# Altium project BV10011_UniversalSlave.PrjPcb
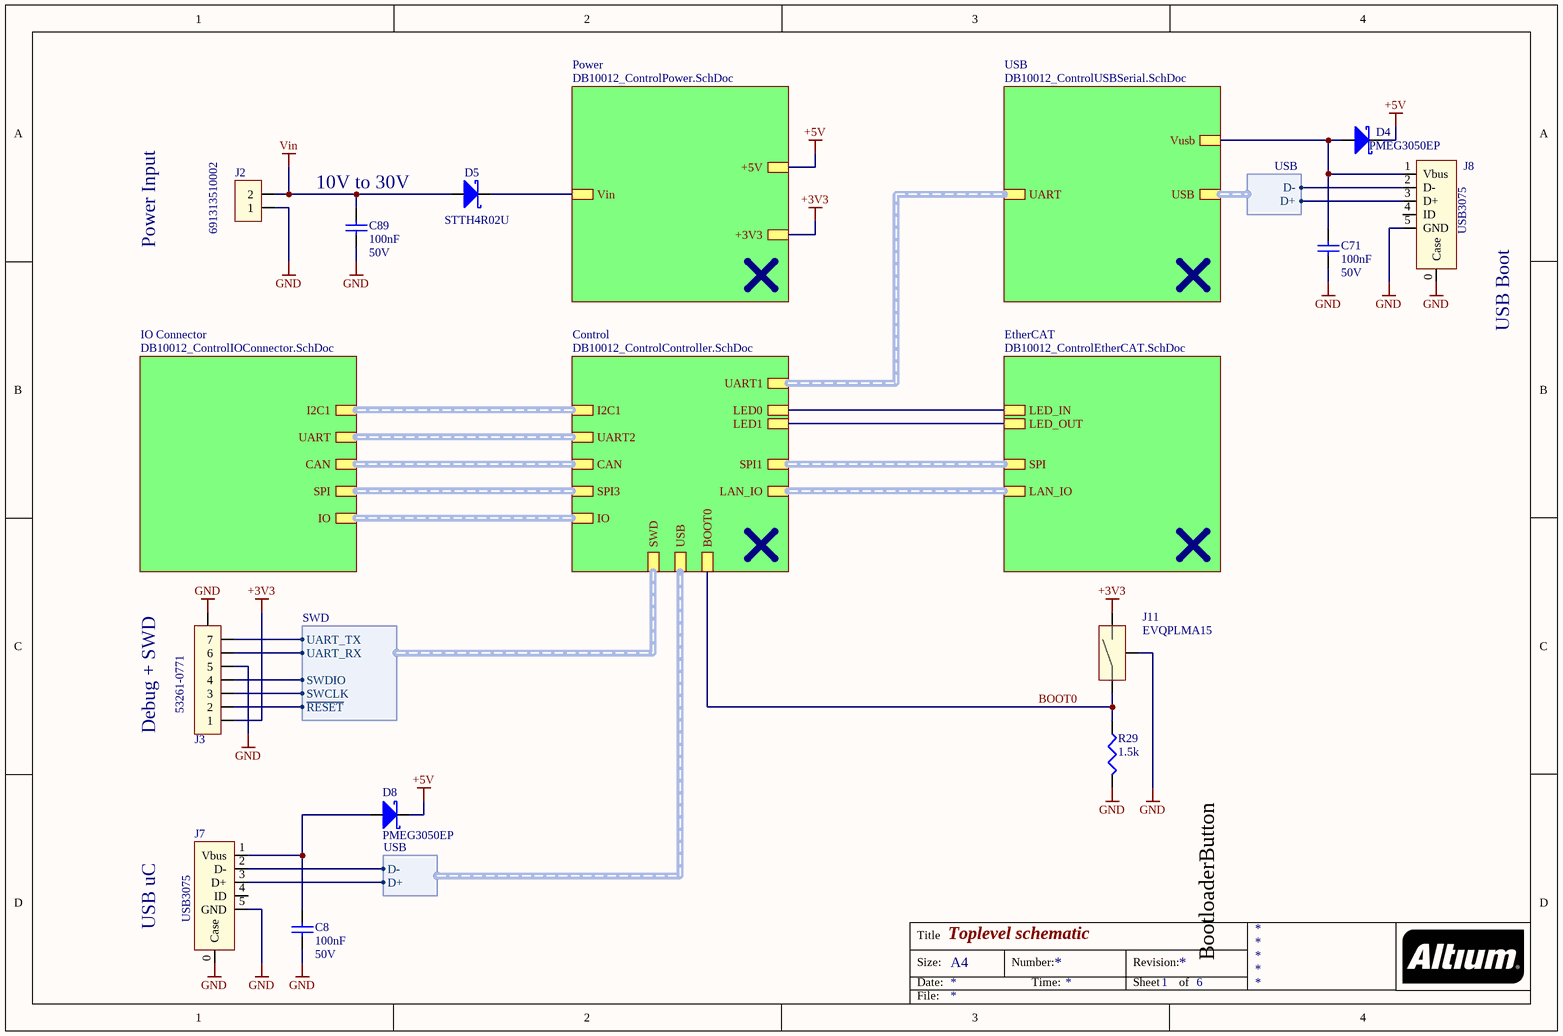
[diagram p0: BV10011_ControlTopLevel.SchDoc]
6 sheets, 118 parts. Net scope: hierarchical (ports join the sheet entries above them; power ports are global).
Board file: BV10011_UniversalSlave.PcbDoc
Sheets:
  BV10011_ControlTopLevel.SchDoc
  BV10011_ControlPower.SchDoc
  BV10011_ControlUSBSerial.SchDoc
  BV10011_ControlEtherCAT.SchDoc
  BV10011_ControlController.SchDoc
  BV10011_ControlIOConnector.SchDoc

## Sheet BV10011_ControlTopLevel.SchDoc: Toplevel schematic
size A4; SheetNumber: 1; SheetTotal: 6

### Parts
C8  100nF  Voltage Rating: 50V  [C-0805]
C71  100nF  Voltage Rating: 50V  [C-0805]
C89  100nF  Voltage Rating: 50V  [C-0805]
D4  PMEG3050EP  [SOD128]
D5  STTH4R02U  [CASE 403A-03]
D8  PMEG3050EP  [SOD128]
J2  691313510002  [691313510002]
J3  53261-0771  [53261-0771]
J7  USB3075  [USB3075 - NOSLOT]
J8  USB3075  [USB3075 - NOSLOT]
J11  EVQPLMA15  [EVQPLM]
R29  1.5k  [0402]

### Sub-sheets
Control = DB10012_ControlController.SchDoc (file not in this document): SPI1 (harness SPI), LAN_IO (harness LAN_IO), UART1 (harness UART), SPI3 (harness SPI), I2C1 (harness I2C1), CAN (harness CAN), UART2 (harness UART), IO (harness IO), USB (harness USB), SWD (harness SWD), BOOT0, LED0, LED1
EtherCAT = DB10012_ControlEtherCAT.SchDoc (file not in this document): SPI (harness SPI), LAN_IO (harness LAN_IO), LED_IN, LED_OUT
IO Connector = DB10012_ControlIOConnector.SchDoc (file not in this document): SPI (harness SPI), I2C1 (harness I2C1), CAN (harness CAN), IO (harness IO), UART (harness UART)
Power = DB10012_ControlPower.SchDoc (file not in this document): +5V, +3V3, Vin
USB = DB10012_ControlUSBSerial.SchDoc (file not in this document): UART (harness UART), USB (harness USB), Vusb

### Harnesses
SWD: UART_TX, UART_RX, SWDIO, SWCLK, ~{RESET}
USB: D-, D+

### Nets
+3V3: J3.1 J11.2 ; sheet Power/+3V3
+5V: D4.2(K) D8.2(K) ; sheet Power/+5V
GND: C8.1 C71.1 C89.1 J2.1 J3.0(SHLD) J3.5 J7.0(Case) J7.5(GND) J8.0(Case) J8.5(GND) J11.0(GND) R29.1
Vin: C89.2 D5.1(A) J2.2
BOOT0: J11.1 R29.2 ; sheet Control/BOOT0
NetC8_2: C8.2 D8.1(A) J7.1(Vbus)
NetC71_2: C71.2 D4.1(A) J8.1(Vbus) ; sheet USB/Vusb
NetD5_2: D5.2(K) ; sheet Power/Vin
NetJ3_2: J3.2 ; sheet Control/SWD.~{RESET}
NetJ3_3: J3.3 ; sheet Control/SWD.SWCLK
NetJ3_4: J3.4 ; sheet Control/SWD.SWDIO
NetJ3_6: J3.6 ; sheet Control/SWD.UART_RX
NetJ3_7: J3.7 ; sheet Control/SWD.UART_TX
NetJ7_2: J7.2(D-) ; sheet Control/USB.D-
NetJ7_3: J7.3(D+) ; sheet Control/USB.D+
NetJ8_2: J8.2(D-) ; sheet USB/USB.D-
NetJ8_3: J8.3(D+) ; sheet USB/USB.D+
(unnamed): sheet EtherCAT/LED_IN, sheet Control/LED0
(unnamed): sheet EtherCAT/LED_OUT, sheet Control/LED1

Not connected (* = marked no-connect by the designer): J7 4(ID); J8 4(ID)

### Buses and harness runs
harness sheet Control/CAN = sheet IO Connector/CAN
harness sheet Control/I2C1 = sheet IO Connector/I2C1
harness sheet Control/IO = sheet IO Connector/IO
harness sheet Control/LAN_IO = sheet EtherCAT/LAN_IO
harness sheet Control/SPI1 = sheet EtherCAT/SPI
harness sheet Control/SPI3 = sheet IO Connector/SPI
harness sheet Control/UART1 = sheet USB/UART
harness sheet Control/UART2 = sheet IO Connector/UART

### Notes on the sheet
- Power Input
- (near C89) 10V to 30V
- USB Boot
- (near J3) Debug + SWD
- BootloaderButton
- USB uC
- Title
- Size:
- Date:
- A4
- Number:
- Time:
- Revision:
- Sheet
- of
- File:

### Library data of the parts
C8 C71 C89 = 100nF/0805/CER/50V: Capacitor, 100nF, 50V,  X7R; Capacitance Tolerance: ± 10%; Capacitor Case Style: 0805; Brand Number: C0805C104K5RACTU; Brand: KEMET; Dielectric Characteristic: X7R; Capacitance: 100nF; Temperature Range: -55°C to +125°C; Price: 0,022; Order Code Supplier: 1414664; Supplier: Farnell
D4 D8 = PMEG3050EP: Diode Schottky, Vrrm: 30V, If: 3A, Vf: 0.36V; Brand: NXP; Case Style: SOD-128; Forward Current: 5A; Brand Number: PMEG3050EP; Forward Voltage: 0.36V; Order Code Supplier: 1829197; Price: 0,25; Supplier: Farnell; Temperature Range: -55°C to +150°C; Vrrm: 30V
D5 = STTH4R02U: Diode Schottky, Vrrm: 200V, If: 4A, Vf: 1,05V; Brand: STMICROELECTRONICS; Case Style: SMB; Forward Current: 3A; Forward Voltage: 1,05V; Brand Number: STTH4R02U; Order Code Supplier: 1295277; Price: 1,09; Supplier: Farnell; Temperature Range: -65°C to +150°C; Vrrm: 200V
J2 = 691313510002: WR-TBL 313 Series, 2 Contacts, Header, 5.08 mm; Brand: Wurth; Pitch: 5.08mm; Brand Number: 691313510002; Case Style: WR-TBL 313 Series; Order Code Supplier: 1641993; Price: 0,343; Supplier: Farnell
J3 = 53261-0771: PicoBlade 53261 Series, 7Pin, Right Angle; Brand: Molex; Pitch: 1,25mm; Brand Number: 53261-0771; Case Style: 53261-0771; Order Code Supplier: 1125361; Price: 1,80; Supplier: Farnell
J7 J8 = USB3075: USB 2.0 MICRO B, RCPT, 5POS, SMT; Brand: Global Connector Technology; Brand Number: USB3075-30-A; Case Style: Micro B SMT; Pitch: 0.8mm; Order Code Supplier: 2443116; Price: 0,313; Supplier: Farnell
J11 = EVQPLMA15: SWITCH, TACT, 4.9MM, SMD, 2.6N; Brand: PANASONIC ELECTRONIC COMPONENTS; Brand Number: EVQPLMA15; Price: 0,169; Order Code Supplier: 2079484; Supplier: Farnell
R29 = 1.5k/0402/0063W/50V: Resistor, 1.5k, 0.1%, 0.0625W, 50V, 100PPM, 0402; Brand: VISHAY DRALORIC; Brand Number: CRCW04021K50FKED; Power Rating: 0.063W; Case Style: 0402; Order Code Supplier: 2121624; Price: 0,0054; Resistance: 1.5k; Supplier: Farnell; Temperature Coefficient: ± 100PPM; Temperature Range: -55°C to +125°C; Voltage Rating: 50V

## Sheet BV10011_ControlPower.SchDoc: Power supply
size A4; SheetNumber: 2; SheetTotal: 6
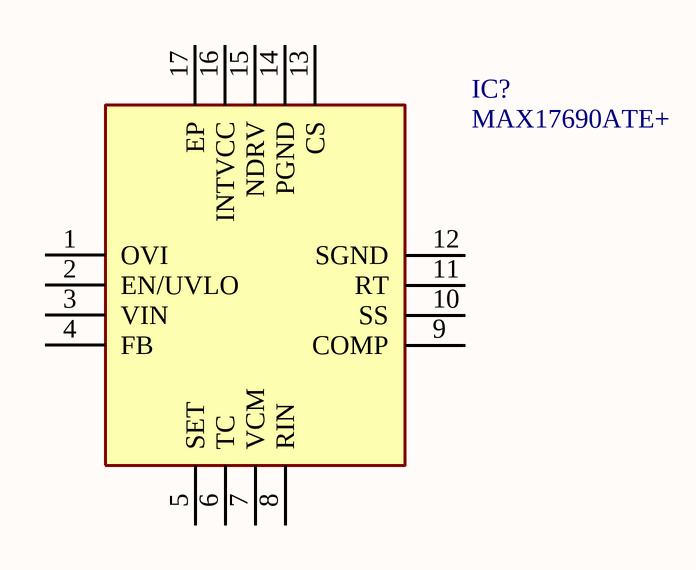
[diagram p1: BV10011_ControlPower.SchDoc]

### Parts
IC?  MAX17690ATE+  [QFN50P300X300X80-17N]

### Nets

Not connected (* = marked no-connect by the designer): IC? 1(OVI) 2(EN/UVLO) 3(VIN) 4(FB) 5(SET) 6(TC) 7(VCM) 8(RIN) 9(COMP) 10(SS) 11(RT) 12(SGND) 13(CS) 14(PGND) 15(NDRV) 16(INTVCC) 17(EP)

### Notes on the sheet
- Title
- Size:
- Date:
- A4
- Number:
- Time:
- Revision:
- Sheet
- of
- File:

### Library data of the parts
IC? = MAX17690ATE+: Integrated Circuit; Manufacturer_Name: Maxim Integrated; Datasheet Link: https://componentsearchengine.com/Datasheets/1/MAX17690ATE+.pdf; Height: 0.8mm; Mouser Part Number: 700-MAX17690ATE+; Mouser Price/Stock: https://www.mouser.com/Search/Refine.aspx?Keyword=700-MAX17690ATE%2B; Manufacturer_Part_Number: MAX17690ATE+

## Sheet BV10011_ControlUSBSerial.SchDoc: USB to serial
size A4; SheetNumber: 3; SheetTotal: 6
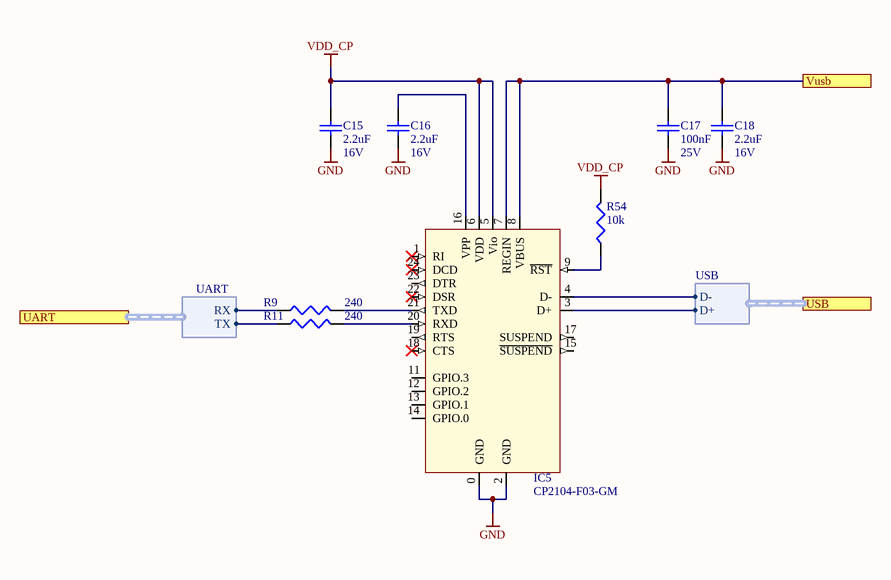
[diagram p2: BV10011_ControlUSBSerial.SchDoc]

### Parts
C15  2.2uF  Voltage Rating: 16V  [C0603]
C16  2.2uF  Voltage Rating: 16V  [C0603]
C17  100nF  Voltage Rating: 25V  [C0402]
C18  2.2uF  Voltage Rating: 16V  [C0603]
IC5  CP2104-F03-GM  [QFN24]
R9  240  [0402]
R11  240  [0402]
R54  10k  [0402]

### Ports
UART (harness UART), USB (harness USB), Vusb

### Harnesses
UART: RX, TX
USB: D-, D+

### Nets
GND: C15.1 C16.1 C17.1 C18.1 IC5.0(GND) IC5.2(GND)
VDD_CP: C15.2 IC5.5(Vio) IC5.6(VDD) R54.2
NetC16_2: C16.2 IC5.16(VPP)
NetC17_2: C17.2 C18.2 IC5.7(REGIN) IC5.8(VBUS) ; port Vusb
NetIC5_3: IC5.3(D+) ; port USB.D+
NetIC5_4: IC5.4(D-) ; port USB.D-
NetIC5_9: IC5.9(~{RST}) R54.1
NetIC5_20: IC5.20(RXD) R11.2
NetIC5_21: IC5.21(TXD) R9.2
NetR9_1: R9.1 ; port UART.RX
NetR11_1: R11.1 ; port UART.TX

Not connected (* = marked no-connect by the designer): IC5 1(RI)* 11(GPIO.3) 12(GPIO.2) 13(GPIO.1) 14(GPIO.0) 15(~{SUSPEND}) 17(SUSPEND) 18(CTS)* 19(RTS) 22(DSR)* 23(DTR) 24(DCD)*

### Notes on the sheet
- Title
- Size:
- Date:
- A4
- Number:
- Time:
- Revision:
- Sheet
- of
- File:

### Library data of the parts
C15 C16 C18 = 2.2uF/0603/CER/16V: Capacitor, 2.2uF, 16V, X5R; Capacitance Tolerance: +/- 10%; Capacitor Case Style: 0603; Brand Number: GRM188R61C225KE15D; Brand: MURATA; Dielectric Characteristic: X5R; Capacitance: 2.2uF; Temperature Range: -55°C to 85°C; Price: 0,077; Order Code Supplier: 1735526; Supplier: Farnell
C17 = 100nF/0402/CER/25V: Capacitor, 100nF, 25V, X7R; Capacitance Tolerance: 10nF; Capacitor Case Style: 0402; Brand Number: GRM155R71E104KE14D; Brand: MULTICOMP; Dielectric Characteristic: X7R; Capacitance: 100nF; Temperature Range: -55 to +125 C; Price: 0,0225; Order Code Supplier: 2456106; Supplier: Farnell
IC5 = CP2104-F03-GM: USB to UART converter; Case Style: QFN24; Price: 1,65; Order Code Supplier: 757-4983; Brand Number: CP2104-F03-GM; Supplier: RS-Components
R9 R11 = 240/0402/0063W/50V: Resistor, 240, 0.1%, 0.0625W, 50V, 100PPM, 0402; Brand: VISHAY DRALORIC; Brand Number: CRCW0402240RFKED; Power Rating: 0.063W; Case Style: 0402; Order Code Supplier: 2121522; Price: 0,0006; Resistance: 240; Supplier: Farnell; Temperature Coefficient: ± 100PPM; Temperature Range: -55°C to +125°C; Voltage Rating: 50V
R54 = 10k/0402/0063W/50V: Resistor, 10k, 0.1%, 0.0625W, 50V, 100PPM, 0402; Brand: VISHAY DRALORIC; Brand Number: CRCW040210K0FKED; Power Rating: 0.063W; Case Style: 0402; Order Code Supplier: 2121730; Price: 0,0005; Resistance: 10k; Supplier: Farnell; Temperature Coefficient: ± 100PPM; Temperature Range: -55°C to +125°C; Voltage Rating: 50V

## Sheet BV10011_ControlEtherCAT.SchDoc: EtherCAT tranceiver
size A2; SheetNumber: 4; SheetTotal: 6
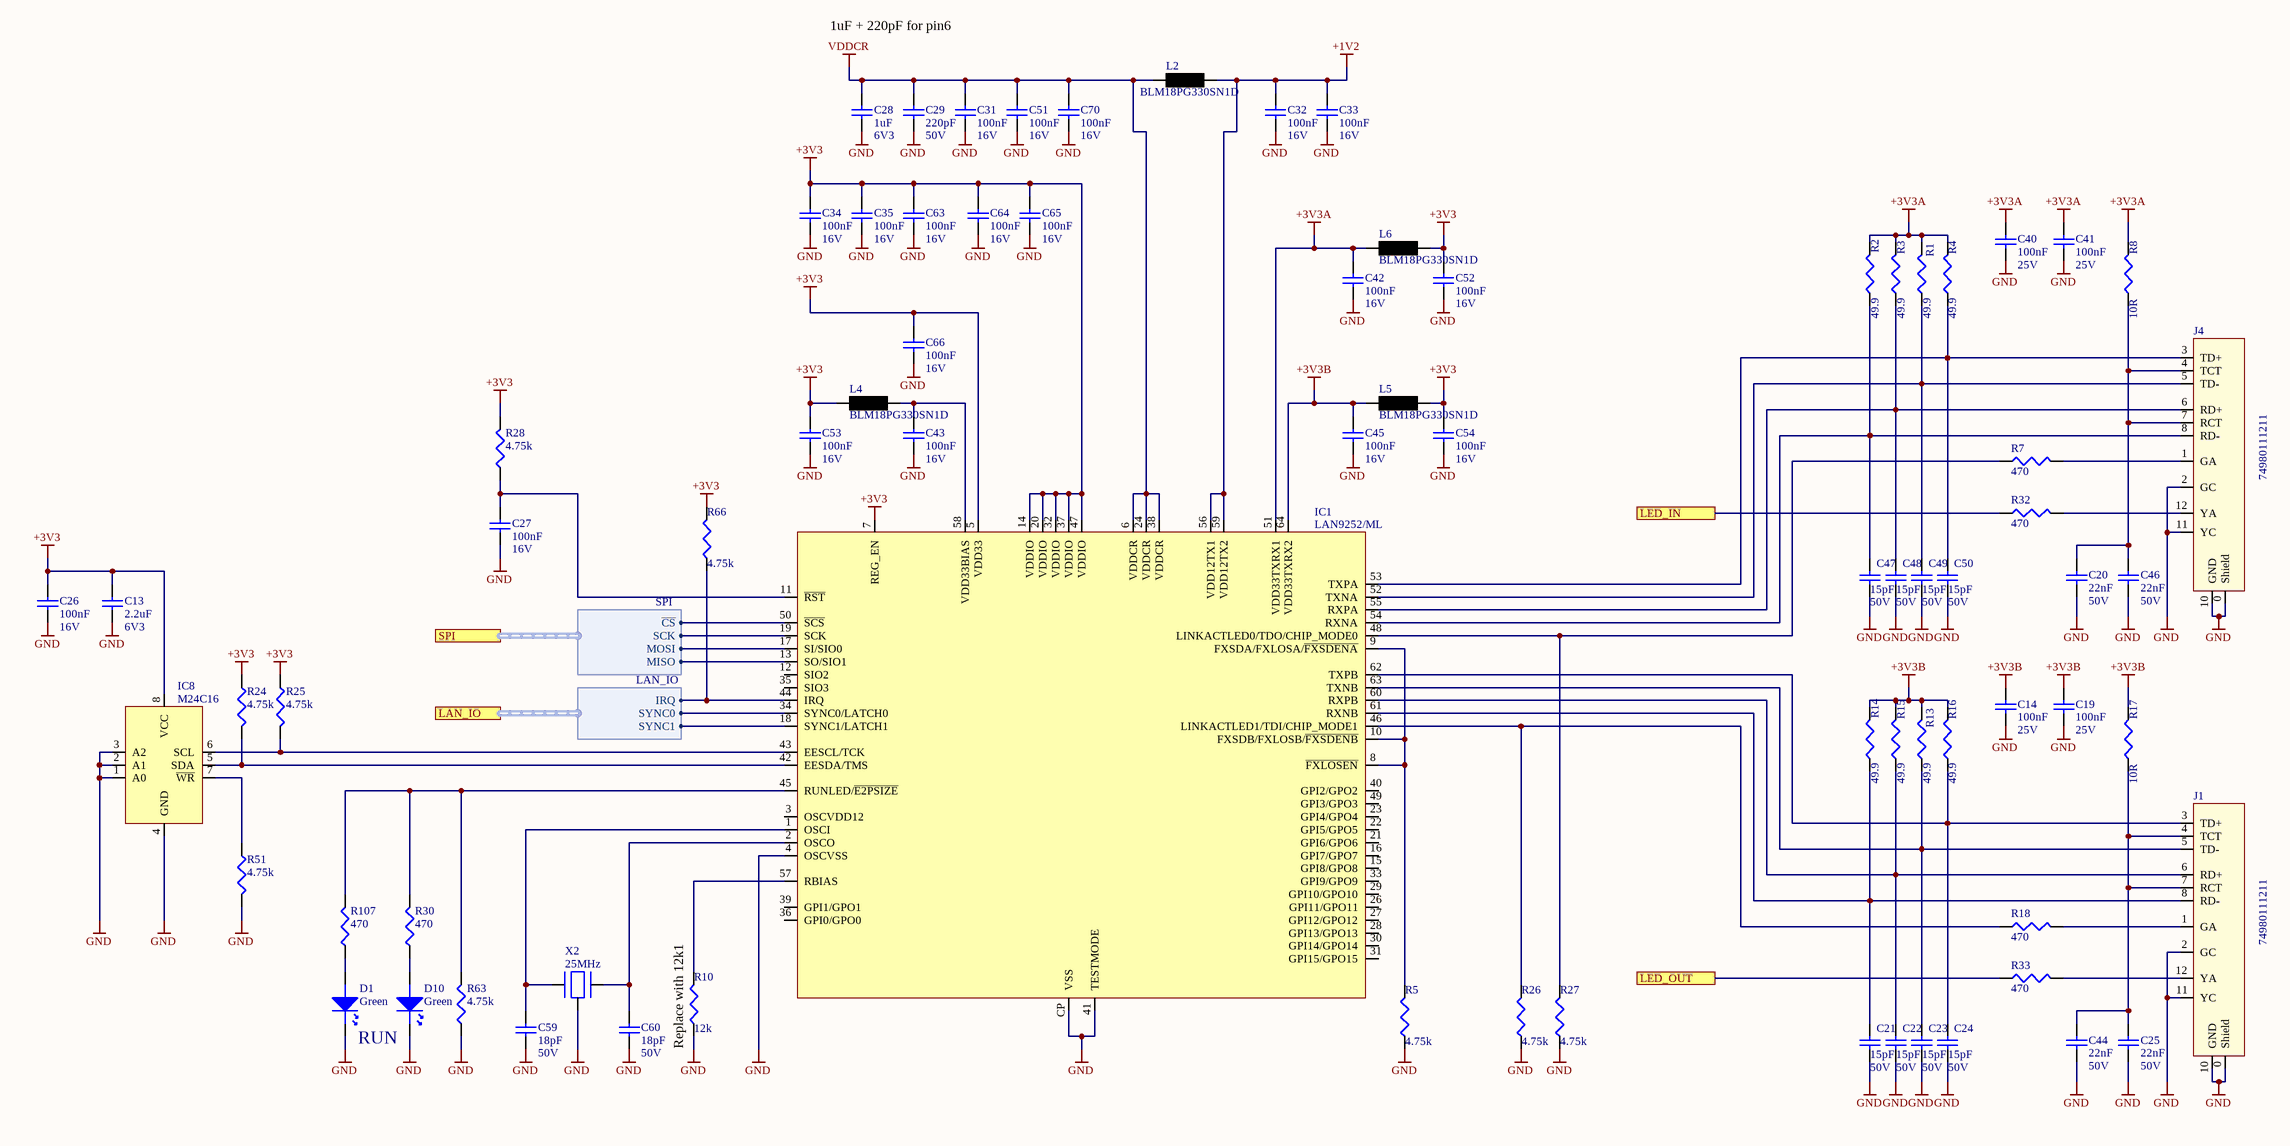
[diagram p3: BV10011_ControlEtherCAT.SchDoc]

### Parts
C13  2.2uF  Voltage Rating: 6V3  [C0402]
C14  100nF  Voltage Rating: 25V  [C0402]
C19  100nF  Voltage Rating: 25V  [C0402]
C20  22nF  Voltage Rating: 50V  [C0402]
C21  15pF  Voltage Rating: 50V  [C0402]
C22  15pF  Voltage Rating: 50V  [C0402]
C23  15pF  Voltage Rating: 50V  [C0402]
C24  15pF  Voltage Rating: 50V  [C0402]
C25  22nF  Voltage Rating: 50V  [C0402]
C26  100nF  Voltage Rating: 16V  [C0402]
C27  100nF  Voltage Rating: 16V  [C0402]
C28  1uF  Voltage Rating: 6V3  [C0402]
C29  220pF  Voltage Rating: 50V  [C0402]
C31  100nF  Voltage Rating: 16V  [C0402]
C32  100nF  Voltage Rating: 16V  [C0402]
C33  100nF  Voltage Rating: 16V  [C0402]
C34  100nF  Voltage Rating: 16V  [C0402]
C35  100nF  Voltage Rating: 16V  [C0402]
C40  100nF  Voltage Rating: 25V  [C0402]
C41  100nF  Voltage Rating: 25V  [C0402]
C42  100nF  Voltage Rating: 16V  [C0402]
C43  100nF  Voltage Rating: 16V  [C0402]
C44  22nF  Voltage Rating: 50V  [C0402]
C45  100nF  Voltage Rating: 16V  [C0402]
C46  22nF  Voltage Rating: 50V  [C0402]
C47  15pF  Voltage Rating: 50V  [C0402]
C48  15pF  Voltage Rating: 50V  [C0402]
C49  15pF  Voltage Rating: 50V  [C0402]
C50  15pF  Voltage Rating: 50V  [C0402]
C51  100nF  Voltage Rating: 16V  [C0402]
C52  100nF  Voltage Rating: 16V  [C0402]
C53  100nF  Voltage Rating: 16V  [C0402]
C54  100nF  Voltage Rating: 16V  [C0402]
C59  18pF  Voltage Rating: 50V  [C0402]
C60  18pF  Voltage Rating: 50V  [C0402]
C63  100nF  Voltage Rating: 16V  [C0402]
C64  100nF  Voltage Rating: 16V  [C0402]
C65  100nF  Voltage Rating: 16V  [C0402]
C66  100nF  Voltage Rating: 16V  [C0402]
C70  100nF  Voltage Rating: 16V  [C0402]
D1  Green  [D-0805]
D10  Green  [D-0805]
IC1  LAN9252/ML  [QFN64_Rect]
IC8  M24C16  [SO-8]
J1  74980111211  [74980111211]
J4  74980111211  [74980111211]
L2  BLM18PG330SN1D  [L0603]
L4  BLM18PG330SN1D  [L0603]
L5  BLM18PG330SN1D  [L0603]
L6  BLM18PG330SN1D  [L0603]
R1  49.9  [0402]
R2  49.9  [0402]
R3  49.9  [0402]
R4  49.9  [0402]
R5  4.75k  [0402]
R7  470  [0402]
R8  10R  [0603]
R10  12k  [0402]
R13  49.9  [0402]
R14  49.9  [0402]
R15  49.9  [0402]
R16  49.9  [0402]
R17  10R  [0603]
R18  470  [0402]
R24  4.75k  [0402]
R25  4.75k  [0402]
R26  4.75k  [0402]
R27  4.75k  [0402]
R28  4.75k  [0402]
R30  470  [0402]
R32  470  [0402]
R33  470  [0402]
R51  4.75k  [0402]
R63  4.75k  [0402]
R66  4.75k  [0402]
R107  470  [0402]
X2  25MHz  [7M]

### Ports
LAN_IO (harness LAN_IO), LED_IN, LED_OUT, SPI (harness SPI)

### Harnesses
SPI: SCK, ~{CS}, MOSI, MISO
LAN_IO: IRQ, SYNC0, SYNC1

### Nets
+1V2: C32.2 C33.2 IC1.56(VDD12TX1) IC1.59(VDD12TX2) L2.2
+3V3: C13.2 C26.2 C34.2 C35.2 C52.2 C53.2 C54.2 C63.2 C64.2 C65.2 C66.2 IC1.5(VDD33) IC1.7(REG_EN) IC1.14(VDDIO) IC1.20(VDDIO) IC1.32(VDDIO) IC1.37(VDDIO) IC1.47(VDDIO) IC8.8(VCC) L4.2 L5.2 L6.2 R24.2 R25.2 R28.2 R66.2
+3V3A: C40.2 C41.2 C42.2 IC1.51(VDD33TXRX1) L6.1 R1.2 R2.2 R3.2 R4.2 R8.2
+3V3B: C14.2 C19.2 C45.2 IC1.64(VDD33TXRX2) L5.1 R13.2 R14.2 R15.2 R16.2 R17.2
GND: C13.1 C14.1 C19.1 C20.1 C21.1 C22.1 C23.1 C24.1 C25.1 C26.1 C27.1 C28.1 C29.1 C31.1 C32.1 C33.1 C34.1 C35.1 C40.1 C41.1 C42.1 C43.1 C44.1 C45.1 C46.1 C47.1 C48.1 C49.1 C50.1 C51.1 C52.1 C53.1 C54.1 C59.1 C60.1 C63.1 C64.1 C65.1 C66.1 C70.1 D1.K D10.K IC1.4(OSCVSS) IC1.41(TESTMODE) IC1.CP(VSS) IC8.1(A0) IC8.2(A1) IC8.3(A2) IC8.4(GND) J1.0(Shield) J1.2(GC) J1.10(GND) J1.11(YC) J4.0(Shield) J4.2(GC) J4.10(GND) J4.11(YC) R5.1 R10.1 R26.1 R27.1 R51.1 R63.1 X2.0
VDDCR: C28.2 C29.2 C31.2 C51.2 C70.2 IC1.6(VDDCR) IC1.24(VDDCR) IC1.38(VDDCR) L2.1
NetC20_2: C20.2 C46.2 J4.4(TCT) J4.7(RCT) R8.1
NetC21_2: C21.2 IC1.61(RXNB) J1.8(RD-) R14.1
NetC22_2: C22.2 IC1.60(RXPB) J1.6(RD+) R15.1
NetC23_2: C23.2 IC1.63(TXNB) J1.5(TD-) R13.1
NetC24_2: C24.2 IC1.62(TXPB) J1.3(TD+) R16.1
NetC25_2: C25.2 C44.2 J1.4(TCT) J1.7(RCT) R17.1
NetC27_2: C27.2 IC1.11(~{RST}) R28.1
NetC43_2: C43.2 IC1.58(VDD33BIAS) L4.1
NetC47_2: C47.2 IC1.54(RXNA) J4.8(RD-) R2.1
NetC48_2: C48.2 IC1.55(RXPA) J4.6(RD+) R3.1
NetC49_2: C49.2 IC1.52(TXNA) J4.5(TD-) R1.1
NetC50_2: C50.2 IC1.53(TXPA) J4.3(TD+) R4.1
NetC59_2: C59.2 IC1.1(OSCI) X2.1
NetC60_2: C60.2 IC1.2(OSCO) X2.2
NetD1_A: D1.A R107.1
NetD10_A: D10.A R30.1
NetIC1_8: IC1.8(~{FXLOSEN}) IC1.9(FXSDA/FXLOSA/~{FXSDENA}) IC1.10(FXSDB/FXLOSB/~{FXSDENB}) R5.2
NetIC1_13: IC1.13(SO/SIO1) ; port SPI.MISO
NetIC1_17: IC1.17(SI/SIO0) ; port SPI.MOSI
NetIC1_18: IC1.18(SYNC1/LATCH1) ; port LAN_IO.SYNC1
NetIC1_19: IC1.19(SCK) ; port SPI.SCK
NetIC1_34: IC1.34(SYNC0/LATCH0) ; port LAN_IO.SYNC0
NetIC1_42: IC1.42(EESDA/TMS) IC8.5(SDA) R24.1
NetIC1_43: IC1.43(EESCL/TCK) IC8.6(SCL) R25.1
NetIC1_44: IC1.44(IRQ) R66.1 ; port LAN_IO.IRQ
NetIC1_45: IC1.45(RUNLED/~{E2PSIZE}) R30.2 R63.2 R107.2
NetIC1_46: IC1.46(LINKACTLED1/TDI/CHIP_MODE1) R18.1 R26.2
NetIC1_48: IC1.48(LINKACTLED0/TDO/CHIP_MODE0) R7.1 R27.2
NetIC1_50: IC1.50(~{SCS}) ; port SPI.~{CS}
NetIC1_57: IC1.57(RBIAS) R10.2
NetIC8_7: IC8.7(~{WR}) R51.2
NetJ1_1: J1.1(GA) R18.2
NetJ1_12: J1.12(YA) R33.2
NetJ4_1: J4.1(GA) R7.2
NetJ4_12: J4.12(YA) R32.2
NetR32_1: R32.1 ; port LED_IN
NetR33_1: R33.1 ; port LED_OUT

Not connected (* = marked no-connect by the designer): IC1 3(OSCVDD12) 12(SIO2) 15(GPI8/GPO8) 16(GPI7/GPO7) 21(GPI6/GPO6) 22(GPI5/GPO5) 23(GPI4/GPO4) 26(GPI11/GPO11) 27(GPI12/GPO12) 28(GPI13/GPO13) 29(GPI10/GPO10) 30(GPI14/GPO14) 31(GPI15/GPO15) 33(GPI9/GPO9) 35(SIO3) 36(GPI0/GPO0) 39(GPI1/GPO1) 40(GPI2/GPO2) 49(GPI3/GPO3)

### Notes on the sheet
- 1uF + 220pF for pin6
- RUN
- (near R10) Replace with 12k1
- Title
- Size:
- Date:
- File:
- A2
- Number:
- Time:
- Revision:
- Sheet
- of

### Library data of the parts
C13 = 2.2uF/0402/CER/6.3V: Capacitor, 2.2uF, 6.3V, X5R; Capacitance Tolerance: ± 10%; Capacitor Case Style: 0402; Brand Number: GRM155R60J225ME15D; Brand: MURATA; Dielectric Characteristic: X5R; Capacitance: 2.2uF; Temperature Range: -55°C to +85°C; Price: 0,818; Order Code Supplier: 2362088; Supplier: Farnell
C14 C19 C40 C41 = 100nF/0402/CER/25V: as C17 on sheet BV10011_ControlUSBSerial; Dielectric Characteristic: X7R; Capacitance: 100nF; Temperature Range: -55 to +125 C; Price: 0,0225; Order Code Supplier: 2456106; Supplier: Farnell
C20 C25 C44 C46 = 22nF/0402/CER/50V: Capacitor, 22nF, 50V, X7R; Capacitance Tolerance: ± 5%; Capacitor Case Style: 0402; Brand Number: GRM155R71H223KA12D; Brand: Murata; Dielectric Characteristic: X7R; Capacitance: 22nF; Temperature Range: -55°C to 125°C; Price: 0,0133; Order Code Supplier: 1828888; Supplier: Farnell
C21-C24 C47-C50 = 15pF/0402/CER/50V: Capacitor, 15pF, 50V, C0G; Capacitance Tolerance: ± 5%; Capacitor Case Style: 0402; Brand Number: GRM1555C1H150JA01D; Brand: Murata; Dielectric Characteristic: C0G; Capacitance: 15pF; Temperature Range: -55°C to 125°C; Price: 0,0097; Order Code Supplier: 2218840; Supplier: Farnell
C26 C27 C31-C35 C42 C43 C45 C51-C54 C63-C66 C70 = 100nF/0402/CER/16V: Capacitor, 100nF, 16V, X7R; Capacitance Tolerance: 10nF; Capacitor Case Style: 0402; Brand Number: GRM155R71C104KA88D; Brand: MURATA; Dielectric Characteristic: X7R; Capacitance: 100nF; Temperature Range: -55 to +125 C; Price: 0,001; Order Code Supplier: 2408523; Supplier: Farnell
C28 = 1uF/0402/CER/6.3V: Capacitor, 1uF, 6.3V, X5R; Capacitance Tolerance: ± 10%; Capacitor Case Style: 0402; Brand Number: 04026D105KAT2A; Brand: AVX; Dielectric Characteristic: X5R; Capacitance: 1uF; Temperature Range: -55°C to +85°C; Price: 0,0874; Order Code Supplier: 1327658; Supplier: Farnell
C29 = 220pF/0402/CER/50V: Capacitor, 220pF, 50V, NP0; Capacitance Tolerance: ± 5%; Capacitor Case Style: 0402; Brand Number: GRM1555C1H221JA01D; Brand: MURATA; Dielectric Characteristic: NP0; Capacitance: 220pF; Temperature Range: -55°C to 125°C; Price: 0,02; Order Code Supplier: 8819580; Supplier: Farnell
C59 C60 = 18pF/0402/CER/50V: Capacitor, 18pF, 50V, NP0; Capacitance Tolerance: ± 5%; Capacitor Case Style: 0402; Brand Number: GRM1555C1H180JA01D; Brand: MURATA; Dielectric Characteristic: NP0; Capacitance: 18pF; Temperature Range: -55°C to 125°C; Price: 0,0177; Order Code Supplier: 1828876; Supplier: Farnell
D1 D10 = KP-2012SGC: Led, Green, Li:12mcd, Vf:2.2V, If:0.02A; Brand: KingBright; Case Style: 0805; Forward Current: 0.02A; Forward Voltage: 2.2V; Luminous Intensity: 12mcd; Brand Number: KP-2012SGC; Order Code Supplier: 1318243; Price: 0,06; Supplier: Farnell; Temperature Range: -30°C to +85°C
IC1 = LAN9252/ML: EtherCAT Slave Controller; Brand: Microchip; Case Style: QFN64; Brand Number: LAN9252/ML; Order Code Supplier: 579-LAN9252/ML; Price: 7,23; Supplier: Mouser; Temperature Range: -55°C to +155°C
IC8 = M24C16-WMN6P: SERIAL EEPROM, 16KBIT, 400KHZ; Brand: ST Micro; Case Style: SO8; Brand Number: M24C16-WMN6P; Order Code Supplier: 9882774; Price: 0,811; Supplier: Farnell; Temperature Range: -55°C to +155°C
J1 J4 = 74980111211: RJ45 With LAN TRANSFRMR; Brand: Wurth; Case Style: SMT RJ45; Brand Number: 74980111211; Order Code Supplier: 2407403; Pitch: -; Price: 9,36; Supplier: Farnell
L2 L4-L6 = BLM18PG330SN1D: Ferrite Bead, Impedance:33ohm, DC Resistance Max:0.025ohm, DC Current Rating:3A; Brand: MURATA; Case Style: 0603; Brand Number: BLM18PG330SN1D; Order Code Supplier: 1515742; Price: 0,048; Supplier: Farnell
R1-R4 R13-R16 = 49.9/0402/0063W/50V: Resistor, 49.9, 0.1%, 0.0625W, 50V, 100PPM, 0402; Brand: VISHAY DRALORIC; Brand Number: CRCW040249R9FKED; Power Rating: 0.063W; Case Style: 0402; Order Code Supplier: 2121437; Price: 0,0004; Resistance: 49.9; Supplier: Farnell; Temperature Coefficient: ± 100PPM; Temperature Range: -55°C to +125°C; Voltage Rating: 50V
R5 R24-R28 R51 R63 R66 = 4.75k/0402/0063W/50V: Resistor, 4.75k, 0.1%, 0.0625W, 50V, 100PPM, 0402; Brand: VISHAY DRALORIC; Brand Number: CRCW04024K75FKED; Power Rating: 0.063W; Case Style: 0402; Order Code Supplier: 2121689; Price: 0,0006; Resistance: 4.75k; Supplier: Farnell; Temperature Coefficient: ± 100PPM; Temperature Range: -55°C to +125°C; Voltage Rating: 50V
R7 R18 R30 R32 R33 R107 = 470/0402/0063W/50V: Resistor, 470, 1%, 0.0625W, 50V, 100PPM, 0402; Brand: VISHAY DRALORIC; Brand Number: CRG0402F470R; Power Rating: 0.063W; Case Style: 0402; Order Code Supplier: 2331533; Price: 0,0099; Resistance: 470; Supplier: Farnell; Temperature Coefficient: ± 100PPM; Temperature Range: -55°C to +125°C; Voltage Rating: 50V
R8 R17 = 10/0603/0125W/50V: Resistor, 10R, 1%, 0.125W, 50V, 200PPM, 0603; Brand: MULTICOMP; Brand Number: MCHP03W8F100JT5E; Case Style: 0603; Order Code Supplier: 1576250; Power Rating: 0.125W; Price: 0,08; Resistance: 10R; Supplier: Farnell; Temperature Coefficient: ± 200PPM; Temperature Range: -55°C to +155°C; Voltage Rating: 50V
R10 = 12k/0402/0063W/50V: Resistor, 12k, 1%, 0.0625W, 50V, 100PPM, 0402; Brand: TE CONNECTIVITY; Brand Number: CRG0402F12K; Power Rating: 0.063W; Case Style: 0402; Order Code Supplier: 2331453; Price: 0,0075; Resistance: 12k; Supplier: Farnell; Temperature Coefficient: ± 100PPM; Temperature Range: -55°C to +125°C; Voltage Rating: 50V
X2 = 7M-25.000MAAJ-T: CRYSTAL, 25MHz,18PF CL, 3.2X2.5MM SMT; Brand: TXC; Price: 0,995; Supplier: Farnell; Order Code Supplier: 1842068; Brand Number: 7M-25.000MAAJ-T

## Sheet BV10011_ControlController.SchDoc: Microcontroller
size A3; SheetNumber: 5; SheetTotal: 6
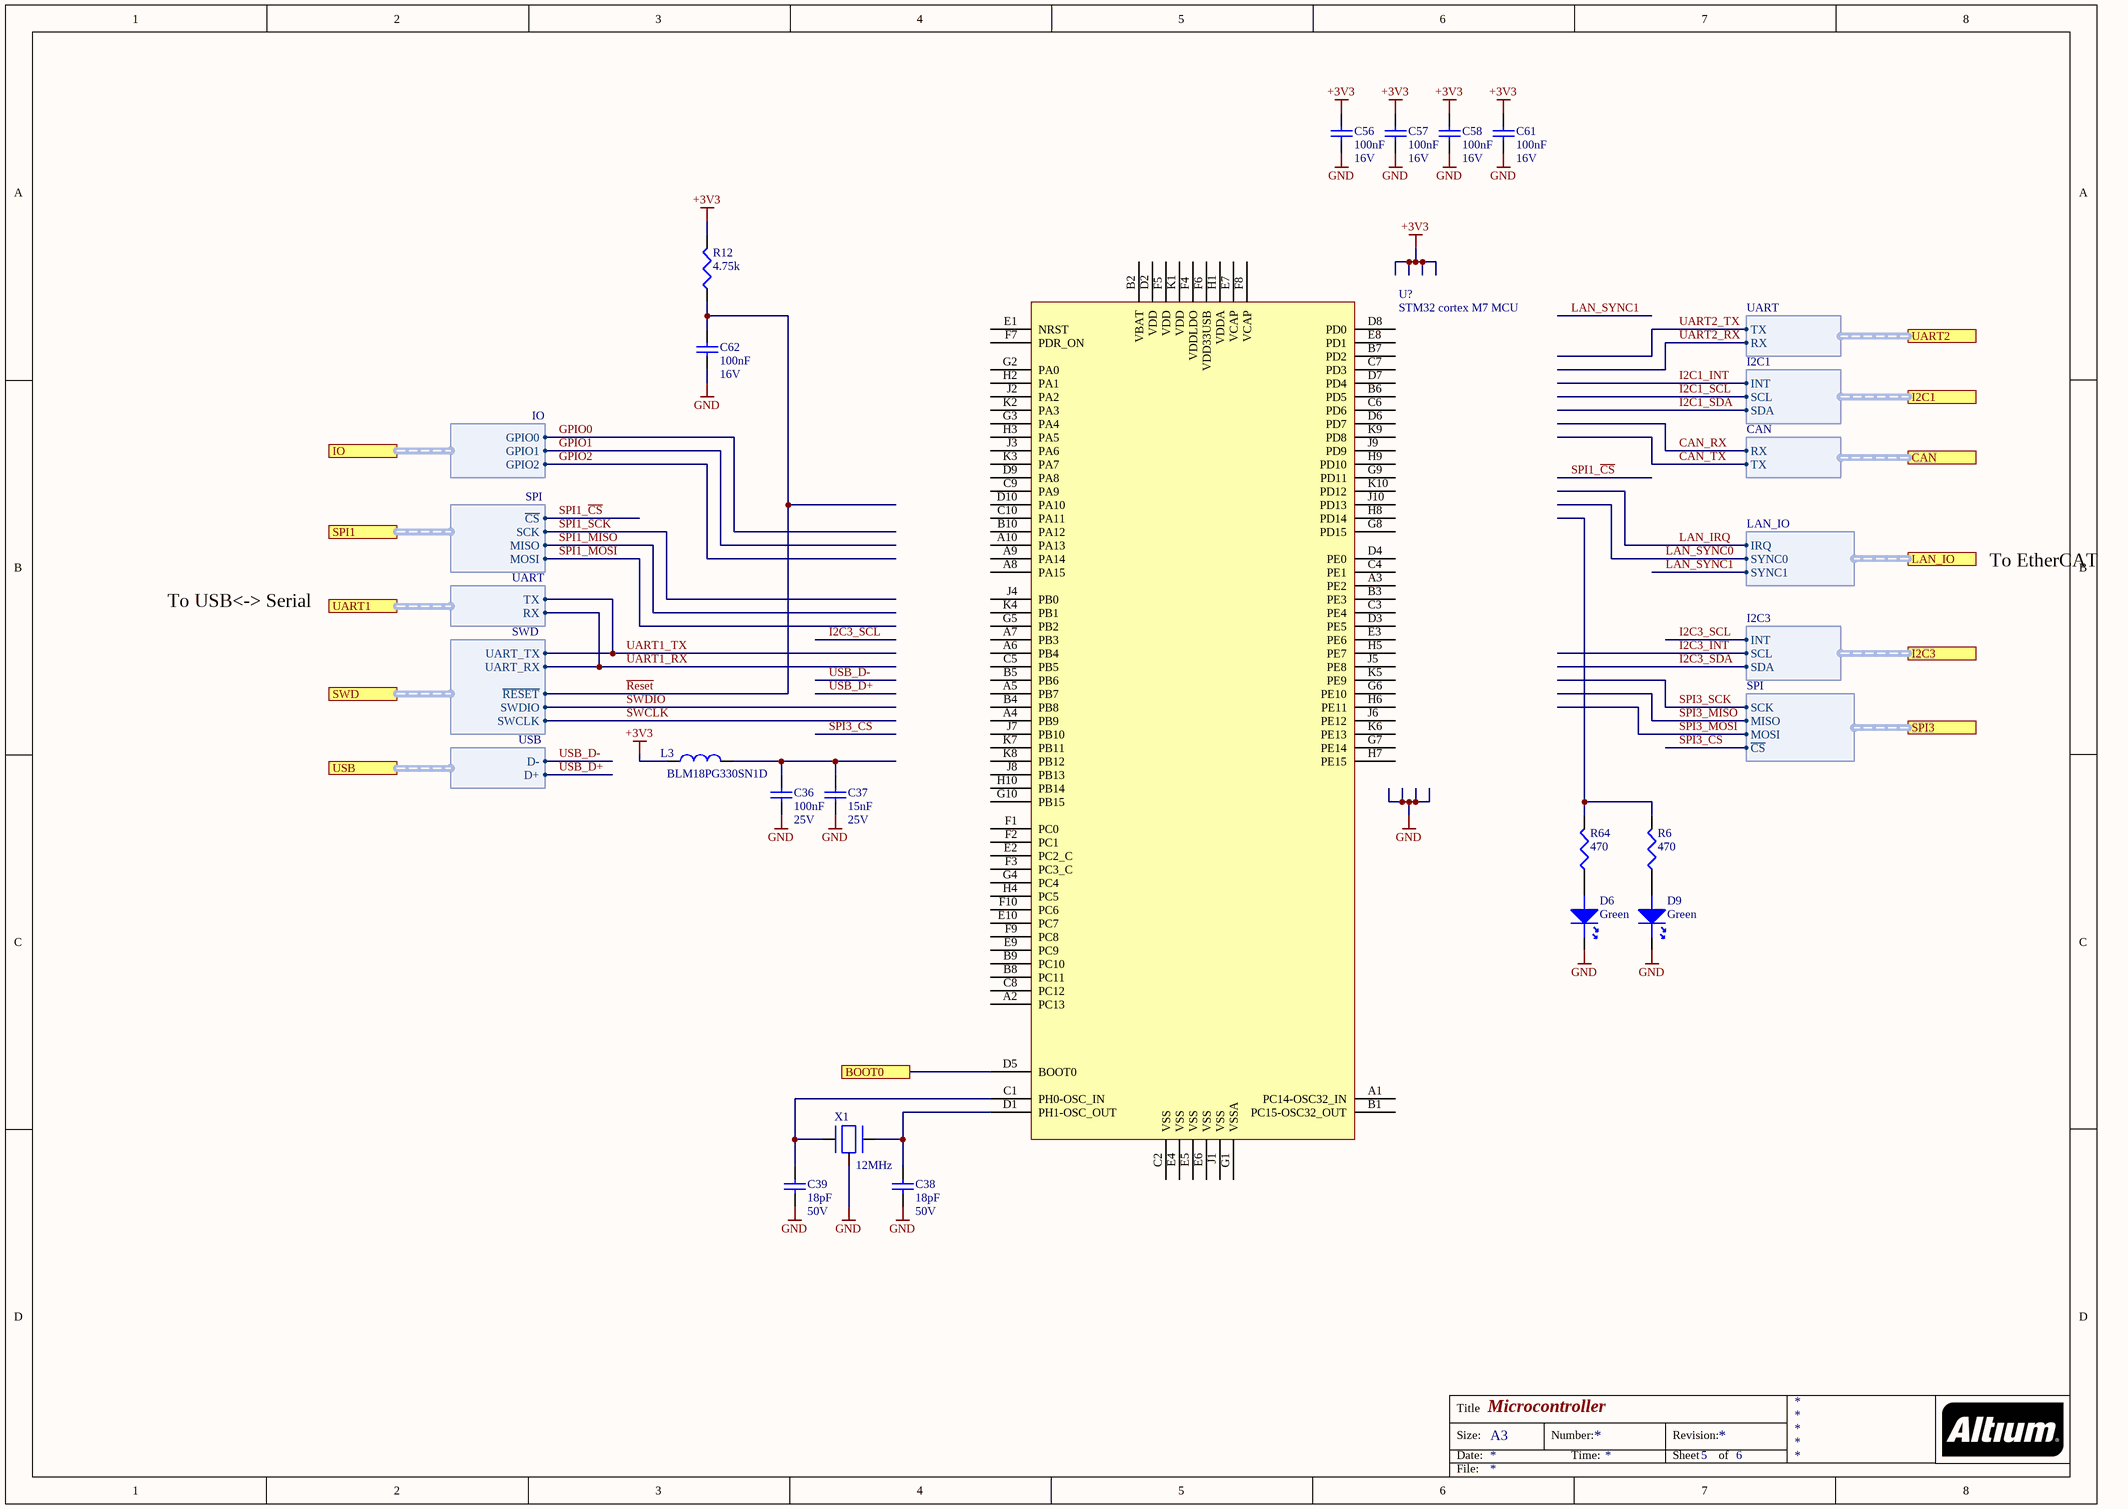
[diagram p4: BV10011_ControlController.SchDoc]

### Parts
C36  100nF  Voltage Rating: 25V  [C0402]
C37  15nF  Voltage Rating: 25V  [C0402]
C38  18pF  Voltage Rating: 50V  [C0402]
C39  18pF  Voltage Rating: 50V  [C0402]
C56  100nF  Voltage Rating: 16V  [C0402]
C57  100nF  Voltage Rating: 16V  [C0402]
C58  100nF  Voltage Rating: 16V  [C0402]
C61  100nF  Voltage Rating: 16V  [C0402]
C62  100nF  Voltage Rating: 16V  [C0402]
D6  Green  [D-0805]
D9  Green  [D-0805]
L3  BLM18PG330SN1D  [L0603]
R6  470  [0402]
R12  4.75k  [0402]
R64  470  [0402]
U?  STM32 cortex M7 MCU  [BGA100C80P10X10_800X800X110]
X1  12MHz  [7M]

### Ports
BOOT0, CAN (harness CAN), I2C1 (harness I2C1), I2C3 (harness I2C3), IO (harness IO), LAN_IO (harness LAN_IO), SPI1 (harness SPI), SPI3 (harness SPI), SWD (harness SWD), UART1 (harness UART), UART2 (harness UART), USB (harness USB)

### Harnesses
SWD: UART_TX, UART_RX, SWDIO, SWCLK, ~{RESET}
SPI: SCK, ~{CS}, MOSI, MISO
LAN_IO: IRQ, SYNC0, SYNC1
UART: TX, RX
USB: D-, D+
CAN: TX, RX
I2C1: INT, SCL, SDA
IO: GPIO0, GPIO1, GPIO2
I2C3: INT, SCL, SDA

### Nets
+3V3: C56.2 C57.2 C58.2 C61.2 L3.2 R12.2
GND: C36.1 C37.1 C38.1 C39.1 C56.1 C57.1 C58.1 C61.1 C62.1 D6.K D9.K X1.0
CAN_RX: port CAN.RX
CAN_TX: port CAN.TX
GPIO0: port IO.GPIO0
GPIO1: port IO.GPIO1
GPIO2: port IO.GPIO2
I2C1_INT: port I2C1.INT
I2C1_SCL: port I2C1.SCL
I2C1_SDA: port I2C1.SDA
I2C3_INT: port I2C3.SCL
I2C3_SCL: port I2C3.INT
I2C3_SDA: port I2C3.SDA
LAN_IRQ: port LAN_IO.IRQ
LAN_SYNC0: port LAN_IO.SYNC0
LAN_SYNC1: port LAN_IO.SYNC1
~{Reset}: C62.2 R12.1 ; port SWD.~{RESET}
SPI1_~{CS}: port SPI1.~{CS}
SPI1_MISO: port SPI1.MISO
SPI1_MOSI: port SPI1.MOSI
SPI1_SCK: port SPI1.SCK
SPI3_~{CS}: port SPI3.~{CS}
SPI3_MISO: port SPI3.MISO
SPI3_MOSI: port SPI3.MOSI
SPI3_SCK: port SPI3.SCK
SWCLK: port SWD.SWCLK
SWDIO: port SWD.SWDIO
UART1_RX: port SWD.UART_RX, port UART1.RX
UART1_TX: port SWD.UART_TX, port UART1.TX
UART2_RX: port UART2.RX
UART2_TX: port UART2.TX
USB_D+: port USB.D+
USB_D-: port USB.D-
NetC36_2: C36.2 C37.2 L3.1
NetC38_2: C38.2 U?.D1(PH1-OSC_OUT) X1.1
NetC39_2: C39.2 U?.C1(PH0-OSC_IN) X1.2
NetD6_A: D6.A R64.1
NetD9_A: D9.A R6.1
NetR6_2: R6.2 R64.2
NetU?_D5: U?.D5(BOOT0) ; port BOOT0

Not connected (* = marked no-connect by the designer): U? A1(PC14-OSC32_IN) A2(PC13) A3(PE2) A4(PB9) A5(PB7) A6(PB4) A7(PB3) A8(PA15) A9(PA14) A10(PA13) B1(PC15-OSC32_OUT) B2(VBAT) B3(PE3) B4(PB8) B5(PB6) B6(PD5) B7(PD2) B8(PC11) B9(PC10) B10(PA12) C2(VSS) C3(PE4) C4(PE1) C5(PB5) C6(PD6) C7(PD3) C8(PC12) C9(PA9) C10(PA11) D2(VDD) D3(PE5) D4(PE0) D6(PD7) D7(PD4) D8(PD0) D9(PA8) D10(PA10) E1(NRST) E2(PC2_C) E3(PE6) E4(VSS) E5(VSS) E6(VSS) E7(VCAP) E8(PD1) E9(PC9) E10(PC7) F1(PC0) F2(PC1) F3(PC3_C) F4(VDDLDO) F5(VDD) F6(VDD33USB) F7(PDR_ON) F8(VCAP) F9(PC8) F10(PC6) G1(VSSA) G2(PA0) G3(PA4) G4(PC4) G5(PB2) G6(PE10) G7(PE14) G8(PD15) G9(PD11) G10(PB15) H1(VDDA) H2(PA1) H3(PA5) H4(PC5) H5(PE7) H6(PE11) H7(PE15) H8(PD14) H9(PD10) H10(PB14) J1(VSS) J2(PA2) J3(PA6) J4(PB0) J5(PE8) J6(PE12) J7(PB10) J8(PB13) J9(PD9) J10(PD13) K1(VDD) K2(PA3) K3(PA7) K4(PB1) K5(PE9) K6(PE13) K7(PB11) K8(PB12) K9(PD8) K10(PD12)

### Notes on the sheet
- To EtherCAT
- To USB<-> Serial
- Title
- Size:
- Date:
- A3
- Number:
- Time:
- Revision:
- Sheet
- of
- File:

### Library data of the parts
C36 = 100nF/0402/CER/25V: as C17 on sheet BV10011_ControlUSBSerial; Dielectric Characteristic: X7R; Capacitance: 100nF; Temperature Range: -55 to +125 C; Price: 0,0225; Order Code Supplier: 2456106; Supplier: Farnell
C37 = 15nF/0402/CER/25V: Capacitor, 15nF, 25V, X7R; Capacitance Tolerance: +/-10%; Capacitor Case Style: 0402; Brand Number: GRM155R71E153KA61D; Brand: Murata; Dielectric Characteristic: X7R; Capacitance: 15nF; Temperature Range: -55°C to 125°C; Price: 0,0267; Order Code Supplier: 2470470; Supplier: Farnell
C38 C39 = 18pF/0402/CER/50V: as C59 on sheet BV10011_ControlEtherCAT; Dielectric Characteristic: NP0; Capacitance: 18pF; Temperature Range: -55°C to 125°C; Price: 0,0177; Order Code Supplier: 1828876; Supplier: Farnell
C56-C58 C61 C62 = 100nF/0402/CER/16V: as C26 on sheet BV10011_ControlEtherCAT; Dielectric Characteristic: X7R; Capacitance: 100nF; Temperature Range: -55 to +125 C; Price: 0,001; Order Code Supplier: 2408523; Supplier: Farnell
D6 D9 = KP-2012SGC: as D1 on sheet BV10011_ControlEtherCAT; Brand Number: KP-2012SGC; Order Code Supplier: 1318243; Price: 0,06; Supplier: Farnell; Temperature Range: -30°C to +85°C
L3 = BLM18PG330SN1D: as L2 on sheet BV10011_ControlEtherCAT; Brand Number: BLM18PG330SN1D; Price: 0,048; Supplier: Farnell; Order Code Supplier: 1515742
R6 R64 = 470/0402/0063W/50V: as R7 on sheet BV10011_ControlEtherCAT; Case Style: 0402; Order Code Supplier: 2331533; Price: 0,0099; Resistance: 470; Supplier: Farnell; Temperature Coefficient: ± 100PPM; Temperature Range: -55°C to +125°C; Voltage Rating: 50V
R12 = 4.75k/0402/0063W/50V: as R5 on sheet BV10011_ControlEtherCAT; Case Style: 0402; Order Code Supplier: 2121689; Price: 0,0006; Resistance: 4.75k; Supplier: Farnell; Temperature Coefficient: ± 100PPM; Temperature Range: -55°C to +125°C; Voltage Rating: 50V
U? = STM32H753VIH6
X1 = 7M-12.000MAAJ-T: CRYSTAL, 12MHz,18PF CL, 3.2X2.5MM SMT; Brand: TXC; Order Code Supplier: 1842056; Price: 1,45; Supplier: Farnell; Brand Number: 7M-12.000MAAJ-T

## Sheet BV10011_ControlIOConnector.SchDoc: Header layour - TODO
size A4; SheetNumber: 6; SheetTotal: 6
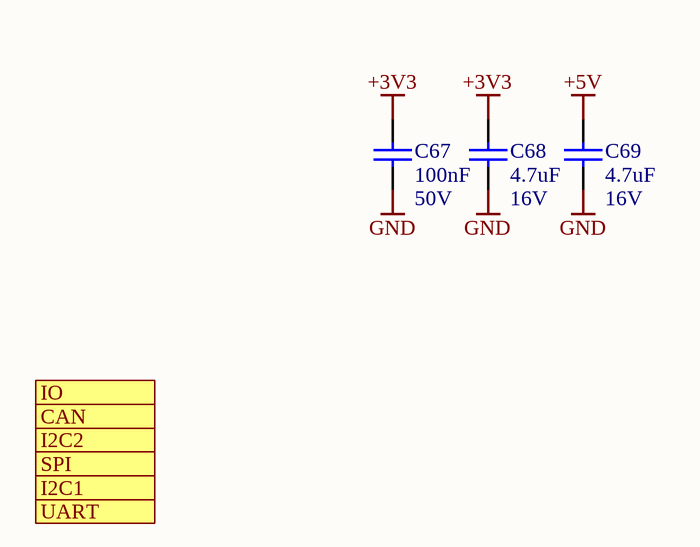
[diagram p5: BV10011_ControlIOConnector.SchDoc]

### Parts
C67  100nF  Voltage Rating: 50V  [C-0805]
C68  4.7uF  Voltage Rating: 16V  [C-0805]
C69  4.7uF  Voltage Rating: 16V  [C-0805]

### Ports
CAN (harness CAN), I2C1 (harness I2C1), I2C2 (harness I2C3), IO (harness IO), SPI (harness SPI), UART (harness UART)

### Nets
+3V3: C67.2 C68.2
+5V: C69.2
GND: C67.1 C68.1 C69.1

### Notes on the sheet
- Title
- Size:
- Date:
- A4
- Number:
- Time:
- Revision:
- Sheet
- of
- File:

### Library data of the parts
C67 = 100nF/0805/CER/50V: as C8 on sheet BV10011_ControlTopLevel; Dielectric Characteristic: X7R; Capacitance: 100nF; Temperature Range: -55°C to +125°C; Price: 0,022; Order Code Supplier: 1414664; Supplier: Farnell
C68 C69 = 4.7uF/0805/CER/16V: Capacitor, 4.7uF, 16V, X7R; Capacitance Tolerance: ± 10%; Capacitor Case Style: 0805; Brand Number: GRM21BR71C475KA73L; Brand: MURATA; Dielectric Characteristic: X7R; Capacitance: 4.7uF; Temperature Range: -55°C to +125°C; Price: 0,26; Order Code Supplier: 1797015; Supplier: Farnell

## Nets that join several sheets
+3V3: BV10011_ControlTopLevel (J3.1 J11.2), BV10011_ControlEtherCAT (26 pins), BV10011_ControlController (6 pins), BV10011_ControlIOConnector (C67.2 C68.2)
+5V: BV10011_ControlTopLevel (D4.2 D8.2), BV10011_ControlIOConnector (C69.2)
GND: BV10011_ControlTopLevel (12 pins), BV10011_ControlUSBSerial (6 pins), BV10011_ControlEtherCAT (64 pins), BV10011_ControlController (12 pins), BV10011_ControlIOConnector (C67.1 C68.1 C69.1)